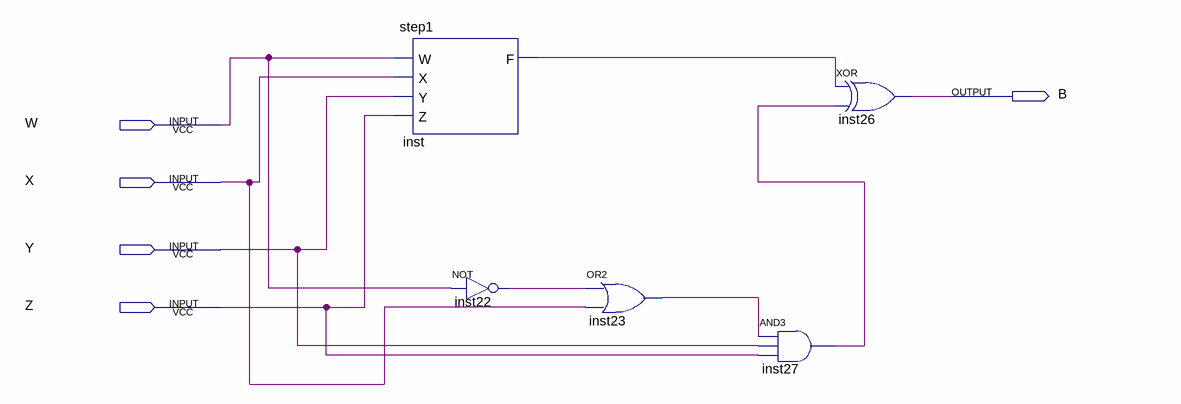
[diagram p0: schematic sheet]
// Quartus schematic step3.bdf as structural Verilog: 5 symbols, 5 pins
module step3 (
  input  W,
  input  X,
  input  Y,
  input  Z,
  output B
);

  wire inst22_out, inst23_out, inst27_out, inst_f;

  step1 inst (.W(W), .X(X), .Y(Y), .Z(Z), .F(inst_f));
  not inst22 (inst22_out, W);
  or inst23 (inst23_out, inst22_out, X);
  and inst27 (inst27_out, inst23_out, Y, Z);
  xor inst26 (B, inst_f, inst27_out);
endmodule
